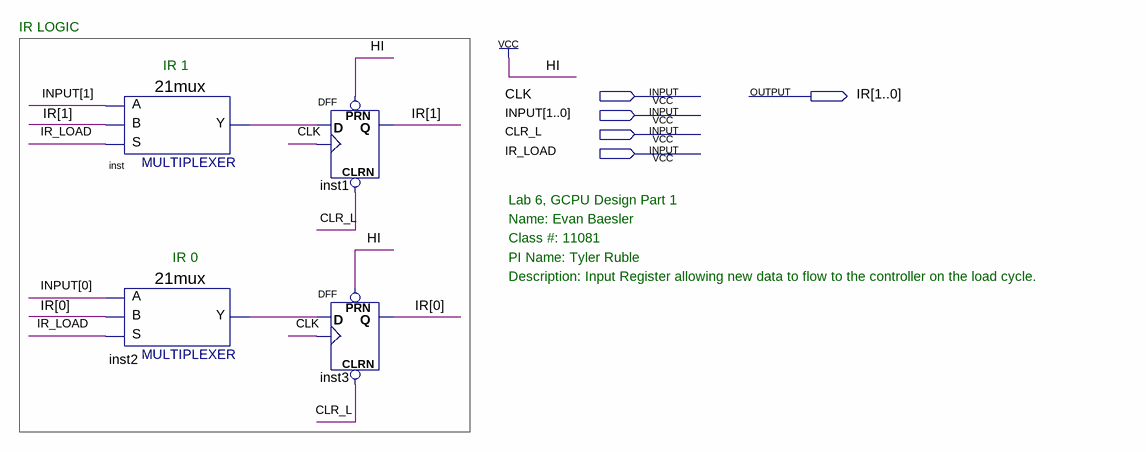
[diagram p0: schematic sheet]
// Quartus schematic LAB6_IR.bdf as structural Verilog: 4 symbols, 5 pins
module LAB6_IR (
  input  CLK,
  input  [1:0] INPUT,
  input  CLR_L,
  input  IR_LOAD,
  output [1:0] IR
);

  wire inst2_y, inst_y;

  \21mux  inst (.S(IR_LOAD), .B(IR[1]), .A(INPUT[1]), .Y(inst_y));
  \21mux  inst2 (.S(IR_LOAD), .B(IR[0]), .A(INPUT[0]), .Y(inst2_y));
  DFF inst1 (.CLRN(CLR_L), .CLK(CLK), .D(inst_y), .PRN(1'b1), .Q(IR[1]));
  DFF inst3 (.CLRN(CLR_L), .CLK(CLK), .D(inst2_y), .PRN(1'b1), .Q(IR[0]));

  // Notes on the sheet:
  //   IR LOGIC
  //   IR 1
  //   Lab 6, GCPU Design Part 1
  //   Name: Evan Baesler
  //   Class #: 11081
  //   IR 0
  //   PI Name: Tyler Ruble
  //   Description: Input Register allowing new data to flow to the controller on the load cycle.
endmodule
